# Altium schematic sheet 62_WIFI.SchDoc: P30L
size A4; Organization: 六零加智能科技; Address4: www.nidone.com.cn; DocumentNumber: Kang jin; Revision: 1.0; SheetNumber: 19; SheetTotal: 23
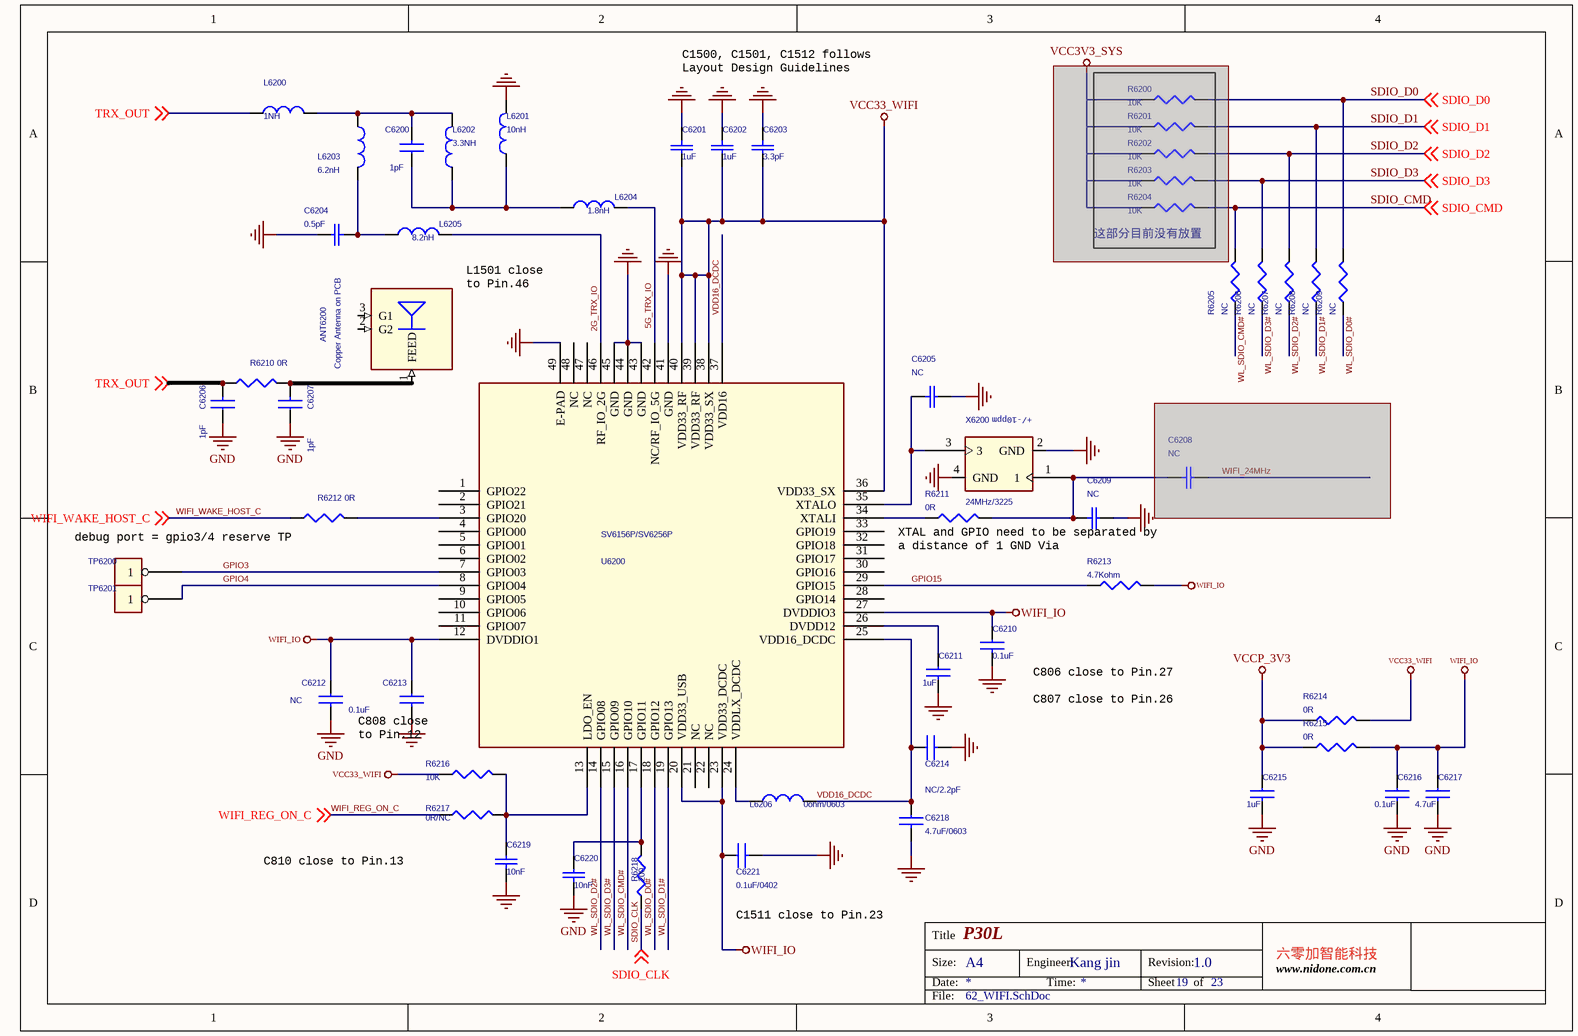
[diagram p0: 62_WIFI.SchDoc]

## Parts
ANT6200  NOTE: Copper Antenna on PCB  [ANT]  (hidden comment: N/A)
C6200  1pF  [C0402]
C6201  1uF  [C0402]
C6202  1uF  [C0402]
C6203  3.3pF  [C0402]
C6204  0.5pF  [C0402]
C6205  NC  [C0402]
C6206  1pF  [C0402]
C6207  1pF  [C0402]
C6208  NC  [C0402]  (masked out: inside a compile mask, not in the netlist)
C6209  NC  [C0402]
C6210  0.1uF  [C0402]
C6211  1uF  [C0402]
C6212  NC  [C0603]
C6213  0.1uF  [C0402]
C6214  NC/2.2pF  [C0402]
C6215  1uF  [C0402]
C6216  0.1uF  [C0402]
C6217  4.7uF  [C0603]
C6218  4.7uF/0603  [C0603]
C6219  10nF  [C0402]
C6220  10nF  [C0402]
C6221  0.1uF/0402  [C0402]
L6200  1NH  [R0402]
L6201  10nH  [R0402]
L6202  3.3NH  [R0402]
L6203  6.2nH  [R0402]
L6204  1.8nH  [R0402]
L6205  8.2nH  [R0402]
L6206  0ohm/0603  [L0603]
R6200  10K  [R0402]  (masked out: inside a compile mask, not in the netlist)
R6201  10K  [R0402]  (masked out: inside a compile mask, not in the netlist)
R6202  10K  [R0402]  (masked out: inside a compile mask, not in the netlist)
R6203  10K  [R0402]  (masked out: inside a compile mask, not in the netlist)
R6204  10K  [R0402]  (masked out: inside a compile mask, not in the netlist)
R6205  NC  [R0402]
R6206  NC  [R0402]
R6207  NC  [R0402]
R6208  NC  [R0402]
R6209  NC  [R0402]
R6210  0R  [R0402]
R6211  0R  [R0402]
R6212  0R  [R0402]
R6213  4.7Kohm  [R0402]
R6214  0R  [R0402]
R6215  0R  [R0402]
R6216  10K  [R0402]
R6217  0R/NC  [R0402]
R6218  200  [R0402]
TP6200  TP/DIP  [TP]  (value not drawn)
TP6201  TP/DIP  [TP]  (value not drawn)
U6200  SV6156P/SV6256P  [QFN48$2F$6X6$2F$P0.4$2F$E4.7]
X6200  24MHz/3225  [CRY-D3225]

## Blocks framed on the sheet
这部分目前没有放置: R6200-R6204

## Nets
GND: C6201.2 C6202.2 C6203.2 C6204.1 C6205.1 C6206.1 C6207.1 C6209.1 C6210.2 C6211.2 C6212.2 C6213.2 C6214.2 C6215.2 C6216.2 C6217.2 C6218.2 C6219.2 C6220.2 C6221.2 L6201.2 U6200.41(GND) U6200.43(GND) U6200.44(GND) U6200.45(GND) U6200.49(E-PAD) X6200.2(GND) X6200.4(GND)
VCC33_WIFI: C6201.1 C6202.1 C6203.1 R6214.2 R6216.1 U6200.36(VDD33_SX) U6200.38(VDD33_SX) U6200.39(VDD33_RF) U6200.40(VDD33_RF)
VCCP_3V3: C6215.1 R6214.1 R6215.1
WIFI_IO: C6210.1 C6212.1 C6213.1 C6216.1 C6217.1 C6221.1 R6213.2 R6215.2 U6200.12(DVDDIO1) U6200.20(VDD33_USB) U6200.23(VDD33_DCDC) U6200.27(DVDDIO3)
2G_TRX_IO: L6205.2 U6200.46(RF_IO_2G)
5G_TRX_IO: L6204.2 U6200.42(NC/RF_IO_5G)
GPIO3: TP6200.1 U6200.7(GPIO03)
GPIO4: TP6201.1 U6200.8(GPIO04)
GPIO15: R6213.1 U6200.29(GPIO15)
SDIO_CLK: R6218.1 ; off-sheet SDIO_CLK
SDIO_CMD: R6205.2 ; off-sheet SDIO_CMD
SDIO_D0: R6209.2 ; off-sheet SDIO_D0
SDIO_D1: R6208.2 ; off-sheet SDIO_D1
SDIO_D2: R6207.2 ; off-sheet SDIO_D2
SDIO_D3: R6206.2 ; off-sheet SDIO_D3
TRX_OUT: C6206.2 L6200.1 R6210.1 ; off-sheet TRX_OUT
VDD16_DCDC: C6214.1 C6218.1 L6206.2 U6200.25(VDD16_DCDC) U6200.37(VDD16)
WIFI_REG_ON_C: R6217.1 ; off-sheet WIFI_REG_ON_C
WIFI_WAKE_HOST_C: R6212.1 ; off-sheet WIFI_WAKE_HOST_C
WL_SDIO_CMD#: R6205.1 U6200.16(GPIO10)
WL_SDIO_D0#: R6209.1 U6200.18(GPIO12)
WL_SDIO_D1#: R6208.1 U6200.19(GPIO13)
WL_SDIO_D2#: R6207.1 U6200.14(GPIO08)
WL_SDIO_D3#: R6206.1 U6200.15(GPIO09)
NetANT6200_1: ANT6200.1(FEED) C6207.2 R6210.2
NetC6200_1: C6200.1 L6201.1 L6202.1 L6204.1
NetC6200_2: C6200.2 L6200.2 L6202.2 L6203.1
NetC6204_2: C6204.2 L6203.2 L6205.1
NetC6205_2: C6205.2 U6200.35(XTALO) X6200.3
NetC6209_2: C6209.2 R6211.2 X6200.1
NetC6211_1: C6211.1 U6200.26(DVDD12)
NetC6219_1: C6219.1 R6216.2 R6217.2 U6200.13(LDO_EN)
NetC6220_1: C6220.1 R6218.2 U6200.17(GPIO11)
NetL6206_1: L6206.1 U6200.24(VDDLX_DCDC)
NetR6211_1: R6211.1 U6200.34(XTALI)
NetR6212_2: R6212.2 U6200.3(GPIO20)

Not connected (* = marked no-connect by the designer): ANT6200 2(G2) 3(G1); U6200 1(GPIO22) 2(GPIO21) 4(GPIO00) 5(GPIO01) 6(GPIO02) 9(GPIO05) 10(GPIO06) 11(GPIO07) 21(NC) 22(NC) 28(GPIO14) 30(GPIO16) 31(GPIO17) 32(GPIO18) 33(GPIO19) 47(NC) 48(NC)

## Notes on the sheet
- C1500, C1501, C1512 follows
  Layout Design Guidelines
- L1501 close
  to Pin.46
- debug port = gpio3/4 reserve TP
- XTAL and GPIO need to be separated by
  a distance of 1 GND Via
- C807 close to Pin.26
- (near C6210) C806 close to Pin.27
- C808 close
  to Pin.12
- C810 close to Pin.13
- C1511 close to Pin.23
- Title
- Size:
- Date:
- A4
- Engineer:
- Time:
- Revision:
- Sheet
- of
- File:
- (in symbol XTAL/26MHz/3225) +/-10ppm

## Library data of the parts
ANT6200 = ANT_IIFA_CC2420_32mil_MIR: Manufacturer Part Number: IIFA_CC2420; Manufacturer: N/A; Part Description: ANT_IIFA_CC2420_32mil_MIR
C6200 C6206 C6207 C6210-C6218 C6221 = C/0603
C6201-C6205 C6208 C6209 C6219 C6220 = C/0402
L6200-L6205 = L/0402
L6206 = L/0603
R6200-R6218 = R/0402(H)
TP6200 TP6201 = TP
U6200 = SV6X56P/48P/6X6
X6200 = XTAL/26MHz/3225